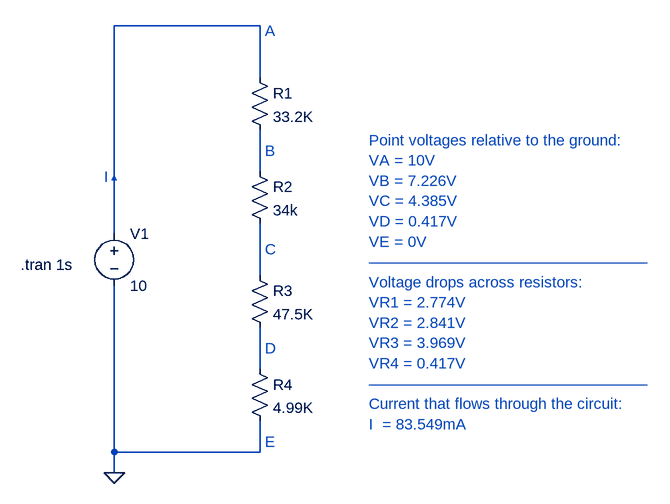
[diagram p0: schematic LAB1 - 1.asc]
LAB1 - 1.asc, the LTspice schematic file:
Version 4
SHEET 1 1036 680
WIRE 416 -32 192 -32
WIRE 416 48 416 -32
WIRE 416 192 416 128
WIRE 192 288 192 -32
WIRE 416 352 416 272
WIRE 416 496 416 432
WIRE 192 624 192 368
WIRE 416 624 416 576
WIRE 416 624 192 624
WIRE 192 656 192 624
FLAG 192 656 0
SYMBOL voltage 192 272 R0
SYMATTR InstName V1
SYMATTR Value 10
SYMBOL res 400 32 R0
SYMATTR InstName R1
SYMATTR Value 33.2K
SYMBOL res 400 176 R0
SYMATTR InstName R2
SYMATTR Value 34k
SYMBOL res 400 336 R0
SYMATTR InstName R3
SYMATTR Value 47.5K
SYMBOL res 400 480 R0
SYMATTR InstName R4
SYMATTR Value 4.99K
TEXT 48 336 Left 2 !.tran 1s
TEXT 424 -24 Left 2 ;A
TEXT 424 160 Left 2 ;B
TEXT 424 312 Left 2 ;C
TEXT 424 464 Left 2 ;D
TEXT 424 608 Left 2 ;E
TEXT 584 144 Left 2 ;Point voltages relative to the ground:\nVA = 10V\nVB = 7.226V\nVC = 4.385V\nVD = 0.417V\nVE = 0V\n——————————————————\nVoltage drops across resistors:\nVR1 = 2.774V\nVR2 = 2.841V\nVR3 = 3.969V\nVR4 = 0.417V\n——————————————————\nCurrent that flows through the circuit:\nI  = 83.549mA
TEXT 184 200 Left 1 ;▲
TEXT 176 200 Left 2 ;I

The netlist it stands for:
* LAB1 - 1.asc
V1 N001 0 10
R1 N001 N002 33.2K
R2 N002 N003 34k
R3 N003 N004 47.5K
R4 N004 0 4.99K
.tran 1s
* A
* B
* C
* D
* E
* Point voltages relative to the ground:
* VA = 10V
* VB = 7.226V
* VC = 4.385V
* VD = 0.417V
* VE = 0V
* ——————————————————
* Voltage drops across resistors:
* VR1 = 2.774V
* VR2 = 2.841V
* VR3 = 3.969V
* VR4 = 0.417V
* ——————————————————
* Current that flows through the circuit:
* I  = 83.549mA
* ▲
* I
.backanno
.end